# Altium schematic sheet adapter-50-100mil-x2.SchDoc
size A
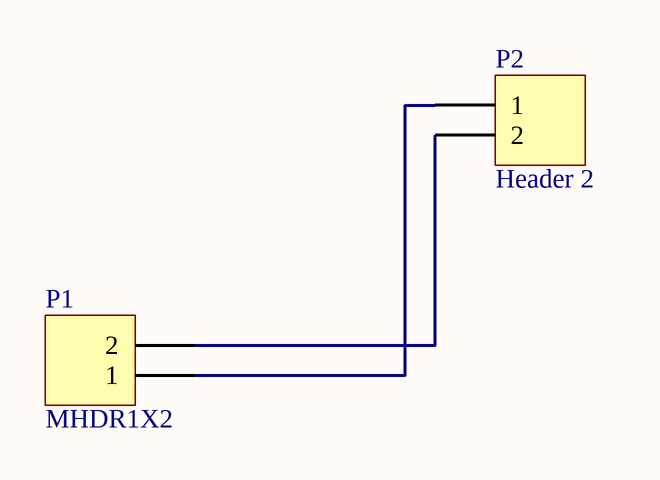
[diagram p0: adapter-50-100mil-x2.SchDoc]

## Parts
P1  MHDR1X2  [MHDR1X2]
P2  Header 2  [HDR1X2]

## Nets
NetP1_1: P1.1 P2.1
NetP1_2: P1.2 P2.2

## Library data of the parts
P1 = MHDR1X2: Header, 2-Pin; LatestRevisionDate: 17-Jul-2002; LatestRevisionNote: Re-released for DXP Platform.; Publisher: Altium Limited
P2 = Header 2: Header, 2-Pin; LatestRevisionDate: 17-Jul-2002; LatestRevisionNote: Re-released for DXP Platform.; Publisher: Altium Limited